# Altium schematic sheet 5DPD8_v1.0_OS_Sheet1.SchDoc: 5DPD8 Controller
size A4; Date: 10th Mar 14; CheckedBy: J. Wong/C. Lai; CompanyName: Makible Ltd.; DrawnBy: Martyn Kay; Engineer: Martyn Kay; Revision: 1.0; SheetNumber: 1; SheetTotal: 4; Website: 5DPrint.com; DesignFileLink: D8 Design Files; BasedOn: Printrboard Rev. B; OSHWLicense: CC BY-SA 4.0
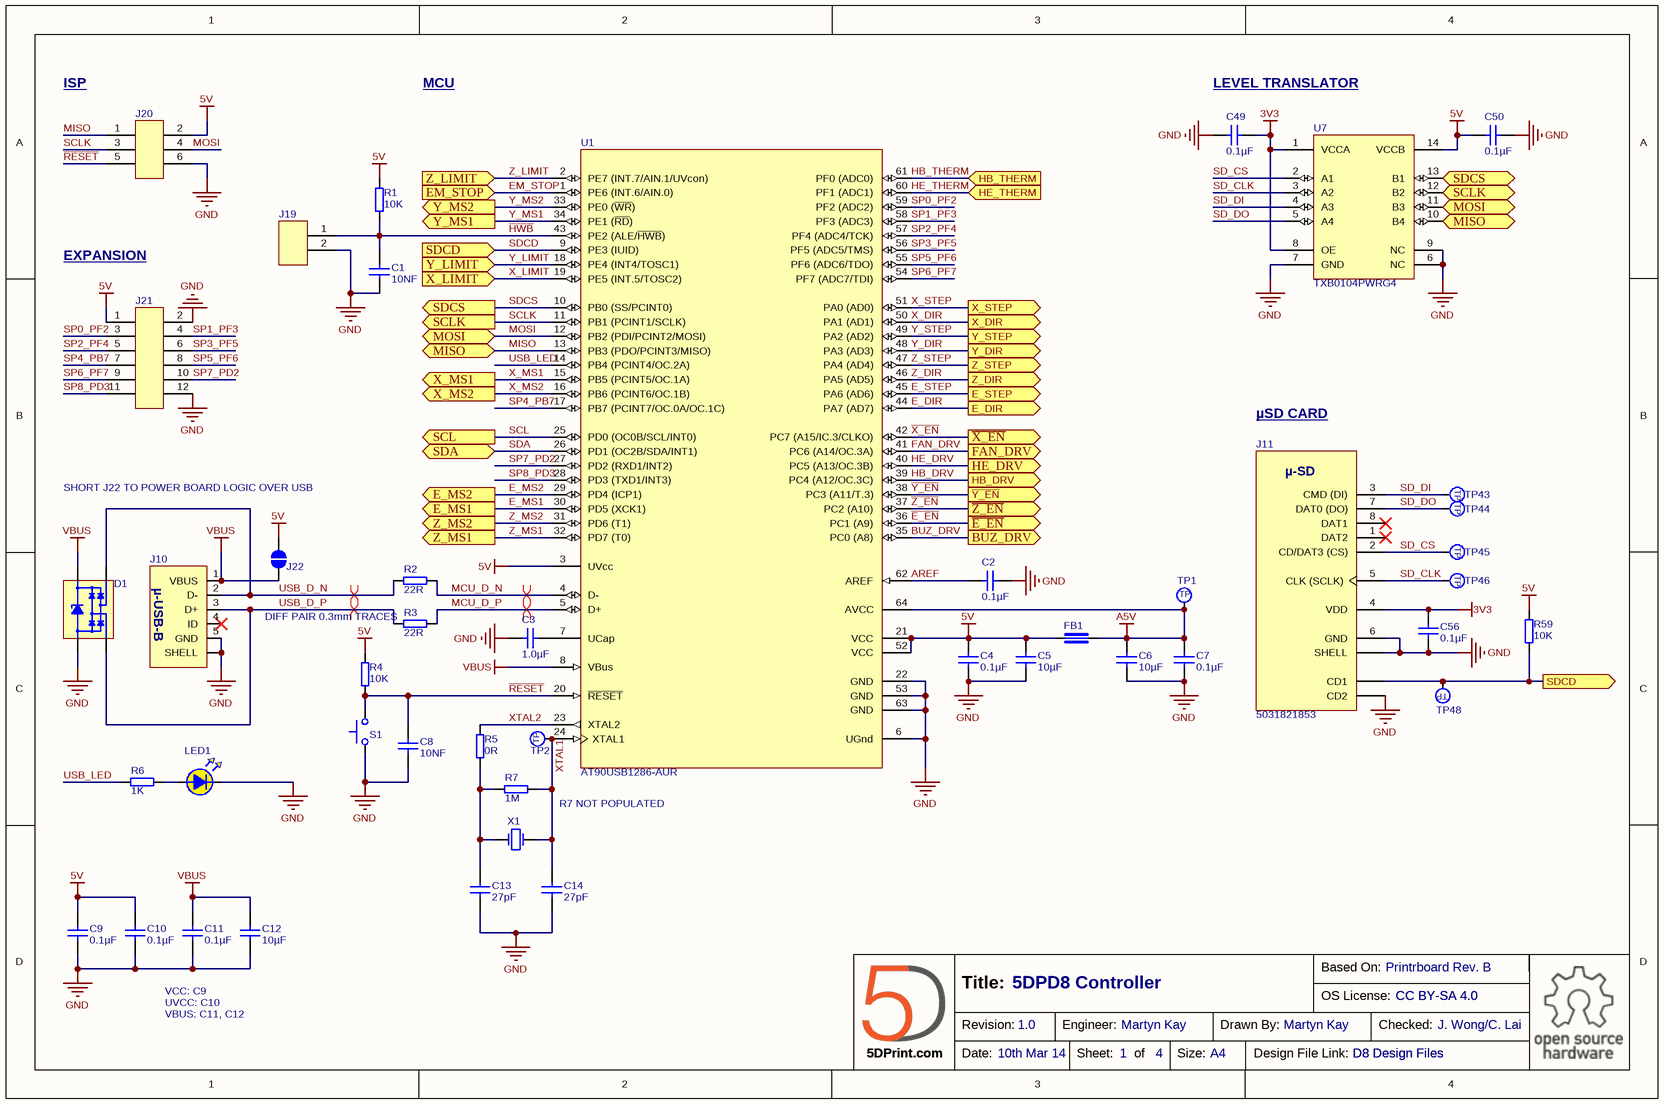
[diagram p0: 5DPD8_v1.0_OS_Sheet1.SchDoc]

## Parts
C1  10NF  [CAPC0603(1608)100_N]
C2  0.1µF  [CAPC0603(1608)100_N]
C3  1.0µF  [CAPC0603(1608)100_N]
C4  0.1µF  [CAPC0603(1608)100_N]
C5  10µF  [CAPC0603(1608)100_N]
C6  10µF  [CAPC0603(1608)100_N]
C7  0.1µF  [CAPC0603(1608)100_N]
C8  10NF  [CAPC0603(1608)100_N]
C9  0.1µF  [CAPC0603(1608)100_N]
C10  0.1µF  [CAPC0603(1608)100_N]
C11  0.1µF  [CAPC0603(1608)100_N]
C12  10µF  [CAPC0603(1608)100_N]
C13  27pF  [CAPC0603(1608)100_N]
C14  27pF  [CAPC0603(1608)100_N]
C49  0.1µF  [CAPC0603(1608)100_N]
C50  0.1µF  [CAPC0603(1608)100_N]
C56  0.1µF  [CAPC0603(1608)100_N]
D1  PRTR5V0U2AX,235  [SOT143B(NXP)]  (value not drawn)
FB1  MMZ1608R301A  [INDC0603(1608)_N]  (value not drawn)
J10  10103594-0001LF  [FCI_THT uUSB]  (value not drawn)
J11  5031821853  [MOLEX_503182-1853]
J19  67996-402HLF  [FCI_67996-402HLF]  (value not drawn)
J20  67996-406HLF  [FCI_67996-406HLF]  (value not drawn)
J21  67996-412HLF  [FCI_67996-412HLF]  (value not drawn)
J22  SOLDER JUMPER  [SOLDER_JUMP]  (value not drawn)  (no BOM)
LED1  HSMY-C190  [LEDC0603(1608)_N-YEL]  (value not drawn)
R1  10K  [RESC0603(1608)_N]
R2  22R  [RESC0603(1608)_N]
R3  22R  [RESC0603(1608)_N]
R4  10K  [RESC0603(1608)_N]
R5  0R  [RESC0603(1608)_N]
R6  1K  [RESC0603(1608)_N]
R7  1M  [RESC0603(1608)_N]  (no BOM)
R59  10K  [RESC0603(1608)_N]
S1  PTS810 SJK 250 SMTR LFS  [PTS810]  (value not drawn)
TP1  TESTPOINT  [TESTPOINT]  (value not drawn)  (no BOM)
TP2  TESTPOINT  [TESTPOINT]  (value not drawn)  (no BOM)
TP43  TESTPOINT  [TESTPOINT]  (value not drawn)  (no BOM)
TP44  TESTPOINT  [TESTPOINT]  (value not drawn)  (no BOM)
TP45  TESTPOINT  [TESTPOINT]  (value not drawn)  (no BOM)
TP46  TESTPOINT  [TESTPOINT]  (value not drawn)  (no BOM)
TP48  TESTPOINT  [TESTPOINT]  (value not drawn)  (no BOM)
U1  AT90USB1286-AUR  [QFP80P1600X1600X120-64_N]
U7  TXB0104PWRG4  [TI-PW14_N]
X1  ABLS-16.000MHZ-K4T  [HC-49US]  (value not drawn)

## Ports
BUZ_DRV (out), E_DIR (out), E_MS1 (out), E_MS2 (out), E_STEP (out), EM_STOP (in), FAN_DRV (out), HB_DRV (out), HB_THERM (in), HE_DRV (out), HE_THERM (in), MISO (bidir), MOSI (bidir), SCL (out), SCLK (in), SCLK (out), SDA (bidir), SDCD (in), SDCD (out), SDCS (in), SDCS (out), X_DIR (out), X_LIMIT (in), X_MS1 (out), X_MS2 (out), X_STEP (out), Y_DIR (out), Y_LIMIT (in), Y_MS1 (out), Y_MS2 (out), Y_STEP (out), Z_DIR (out), Z_LIMIT (in), Z_MS1 (out), Z_MS2 (out), Z_STEP (out), ~{E_EN} (out), ~{X_EN} (out), ~{Y_EN} (out), ~{Z_EN} (out)

## Nets
3V3: C49.2 C56.2 J11.4(VDD) U7.1(VCCA) U7.8(OE)
5V: C4.2 C5.2 C9.2 C10.2 C50.1 FB1.1 J20.2 J21.1 J22.2 R1.2 R4.2 R59.2 U1.3(UVcc) U1.21(VCC) U1.52(VCC) U7.14(VCCB)
A5V: C6.2 C7.2 FB1.2 TP1.1 U1.64(AVCC)
GND: C1.1 C2.2 C3.1 C4.1 C5.1 C6.1 C7.1 C8.1 C9.1 C10.1 C11.1 C12.1 C13.1 C14.1 C49.1 C50.2 C56.1 D1.1(GND) J10.5(GND) J10.M(SHELL) J11.6(GND) J11.CD2 J11.M(SHELL) J19.2 J20.6 J21.2 J21.12 LED1.K S1.1 U1.6(UGnd) U1.22(GND) U1.53(GND) U1.63(GND) U7.6(NC) U7.7(GND) U7.9(NC)
VBUS: C11.2 C12.2 D1.4(VBUS) J10.1(VBUS) J22.1 U1.8(VBus)
AREF: C2.1 U1.62(AREF)
BUZ_DRV: U1.35(PC0_(A8)) ; port BUZ_DRV
~{E_EN}: U1.36(PC1_(A9)) ; port ~{E_EN}
E_DIR: U1.44(PA7_(AD7)) ; port E_DIR
E_MS1: U1.30(PD5_(XCK1)) ; port E_MS1
E_MS2: U1.29(PD4_(ICP1)) ; port E_MS2
E_STEP: U1.45(PA6_(AD6)) ; port E_STEP
EM_STOP: U1.1(PE6_(INT.6/AIN.0)) ; port EM_STOP
FAN_DRV: U1.41(PC6_(A14/OC.3A)) ; port FAN_DRV
~{HWB}: C1.2 J19.1 R1.1 U1.43(PE2_(ALE/~{HWB}))
HB_DRV: U1.39(PC4_(A12/OC.3C)) ; port HB_DRV
HB_THERM: U1.61(PF0_(ADC0)) ; port HB_THERM
HE_DRV: U1.40(PC5_(A13/OC.3B)) ; port HE_DRV
HE_THERM: U1.60(PF1_(ADC1)) ; port HE_THERM
MCU_D_N: R2.2 U1.4(D-)
MCU_D_P: R3.2 U1.5(D+)
MISO: J20.1 U1.13(PB3_(PDO/PCINT3/MISO)) U7.10(B4) ; port MISO
MOSI: J20.4 U1.12(PB2_(PDI/PCINT2/MOSI)) U7.11(B3) ; port MOSI
~{RESET}: C8.2 J20.5 R4.1 S1.3 U1.20(~{RESET})
SCL: U1.25(PD0_(OC0B/SCL/INT0)) ; port SCL
SCLK: J20.3 U1.11(PB1_(PCINT1/SCLK)) U7.12(B2) ; port SCLK
SD_CLK: J11.5(CLK_(SCLK)) TP46.1 U7.3(A2)
SD_CS: J11.2(CD/DAT3_(CS)) TP45.1 U7.2(A1)
SD_DI: J11.3(CMD_(DI)) TP43.1 U7.4(A3)
SD_DO: J11.7(DAT0_(DO)) TP44.1 U7.5(A4)
SDA: U1.26(PD1_(OC2B/SDA/INT1)) ; port SDA
SDCD: J11.CD1 R59.1 TP48.1 U1.9(PE3_(IUID)) ; port SDCD
SDCS: U1.10(PB0_(SS/PCINT0)) U7.13(B1) ; port SDCS
SP0_PF2: J21.3 U1.59(PF2_(ADC2))
SP1_PF3: J21.4 U1.58(PF3_(ADC3))
SP2_PF4: J21.5 U1.57(PF4_(ADC4/TCK))
SP3_PF5: J21.6 U1.56(PF5_(ADC5/TMS))
SP4_PB7: J21.7 U1.17(PB7_(PCINT7/OC.0A/OC.1C))
SP5_PF6: J21.8 U1.55(PF6_(ADC6/TDO))
SP6_PF7: J21.9 U1.54(PF7_(ADC7/TDI))
SP7_PD2: J21.10 U1.27(PD2_(RXD1/INT2))
SP8_PD3: J21.11 U1.28(PD3_(TXD1/INT3))
USB_D_N: D1.3(P2) J10.2(D-) R2.1
USB_D_P: D1.2(P1) J10.3(D+) R3.1
USB_LED: R6.1 U1.14(PB4_(PCINT4/OC.2A))
~{X_EN}: U1.42(PC7_(A15/IC.3/CLKO)) ; port ~{X_EN}
X_DIR: U1.50(PA1_(AD1)) ; port X_DIR
X_LIMIT: U1.19(PE5_(INT.5/TOSC2)) ; port X_LIMIT
X_MS1: U1.15(PB5_(PCINT5/OC.1A)) ; port X_MS1
X_MS2: U1.16(PB6_(PCINT6/OC.1B)) ; port X_MS2
X_STEP: U1.51(PA0_(AD0)) ; port X_STEP
XTAL1: C14.2 R7.2 TP2.1 U1.24(XTAL1) X1.2(OSC2)
XTAL2: R5.2 U1.23(XTAL2)
~{Y_EN}: U1.38(PC3_(A11/T.3)) ; port ~{Y_EN}
Y_DIR: U1.48(PA3_(AD3)) ; port Y_DIR
Y_LIMIT: U1.18(PE4_(INT4/TOSC1)) ; port Y_LIMIT
Y_MS1: U1.34(PE1_(~{RD})) ; port Y_MS1
Y_MS2: U1.33(PE0_(~{WR})) ; port Y_MS2
Y_STEP: U1.49(PA2_(AD2)) ; port Y_STEP
~{Z_EN}: U1.37(PC2_(A10)) ; port ~{Z_EN}
Z_DIR: U1.46(PA5_(AD5)) ; port Z_DIR
Z_LIMIT: U1.2(PE7_(INT.7/AIN.1/UVcon)) ; port Z_LIMIT
Z_MS1: U1.32(PD7_(T0)) ; port Z_MS1
Z_MS2: U1.31(PD6_(T1)) ; port Z_MS2
Z_STEP: U1.47(PA4_(AD4)) ; port Z_STEP
NetC3_2: C3.2 U1.7(UCap)
NetC13_2: C13.2 R5.1 R7.1 X1.1(OSC1)
NetLED1_A: LED1.A R6.2

Not connected (* = marked no-connect by the designer): J10 4(ID)*; J11 1(DAT2)* 8(DAT1)*; S1 2 4

## Layout directives
differential pair: MCU_D_N, MCU_D_P, USB_D_N, USB_D_P

## Notes on the sheet
- ISP
- MCU
- LEVEL TRANSLATOR
- EXPANSION
- µSD CARD
- SHORT J22 TO POWER BOARD LOGIC OVER USB
- DIFF PAIR 0.3mm TRACES
- R7 NOT POPULATED
- VCC: C9
  UVCC: C10
  VBUS: C11, C12
- Based On:
- Title:
- Revision:
- Engineer:
- Drawn By:
- OS License:
- Checked:
- Date:
- Sheet:
- of
- Size:
- A4
- Design File Link:
- (in symbol CON_FCI_10103594-0001LF) µ-USB-B
- (in symbol CON_MLX_503182-1853) µ-SD
- (in symbol TESTPOINT) TP

## Library data of the parts
C1 C8 = C0603-10NF-50V-10%-X7R: CAP CER 10000PF 50V 10% X7R 0603; Manufacturer: Yageo; ManufacturerPartNumber: CC0603KPX7R9BB103; Supplier 1: Digi-Key; RoHS: RoHS Compliant; Category: Capacitors; Stock 1: 15000; Pricing 1: 15000=0.003, 30000=0.00285, 75000=0.00255, 105000=0.00206 (USD); Packaging: Tape & Reel (TR); Capacitance: 10NF; Voltage - Rated: 50V; Tolerance: ±10%; Temperature Coefficient: X7R; Mounting Type: Surface Mount, MLCC; Operating Temperature: -55°C ~ 125°C; Applications: General Purpose; Ratings: -; Package / Case: 0603 (1608 Metric); Size / Dimension: 0.063" L x 0.031" W (1.60mm x 0.80mm); Height - Seated (Max): -; Thickness (Max): 0.035" (0.90mm); Lead Spacing: -; Features: -; Lead Style: -; ComponentLink1URL: http://www.yageo.com/documents/recent/UPY-GPHC_X7R_6.3V-to-50V_8.pdf; ComponentLink1Description: http://www.yageo.com/documents/recent/UPY-GPHC_X7R_6.3V-to-50V_8.pdf; Supplier Part Number 1: 311-1572-2-ND
C2 C4 C7 C9-C11 C49 C50 C56 = C0603-0.1UF-50V-10%-X7R: CAP CER 0.1UF 50V 10% X7R 0603; Manufacturer: Yageo; ManufacturerPartNumber: CC0603KRX7R9BB104; Supplier 1: Digi-Key; RoHS: RoHS Compliant; Category: Capacitors; Stock 1: 2096000; Pricing 1: 4000=0.00513, 8000=0.00468, 12000=0.00446, 28000=0.00424, 100000=0.00307 (USD); Packaging: Tape & Reel (TR); Capacitance: 0.1µF; Voltage - Rated: 50V; Tolerance: ±10%; Temperature Coefficient: X7R; Mounting Type: Surface Mount, MLCC; Operating Temperature: -55°C ~ 125°C; Applications: General Purpose; Ratings: -; Package / Case: 0603 (1608 Metric); Size / Dimension: 0.063" L x 0.031" W (1.60mm x 0.80mm); Height - Seated (Max): -; Thickness (Max): 0.035" (0.90mm); Lead Spacing: -; Features: -; Lead Style: -; ComponentLink1URL: http://www.yageo.com/documents/recent/UPY-GPHC_X7R_6.3V-to-50V_8.pdf; ComponentLink1Description: http://www.yageo.com/documents/recent/UPY-GPHC_X7R_6.3V-to-50V_8.pdf; Supplier Part Number 1: 311-1344-2-ND
C3 = C0603-1UF-10V-10%-X7R: CAP CER 1UF 10V 10% X7R 0603; Manufacturer: Taiyo Yuden; ManufacturerPartNumber: LMK107B7105KA-T; Supplier 1: Digi-Key; RoHS: RoHS Compliant; Category: Capacitors; Stock 1: 116000; Pricing 1: 4000=0.00782, 8000=0.00714, 12000=0.0068, 28000=0.00646 (USD); Packaging: Tape & Reel (TR); Capacitance: 1.0µF; Voltage - Rated: 10V; Tolerance: ±10%; Temperature Coefficient: X7R; Mounting Type: Surface Mount, MLCC; Operating Temperature: -55°C ~ 125°C; Applications: General Purpose; Ratings: -; Package / Case: 0603 (1608 Metric); Size / Dimension: 0.063" L x 0.031" W (1.60mm x 0.80mm); Height - Seated (Max): -; Thickness (Max): 0.035" (0.90mm); Lead Spacing: -; Features: -; Lead Style: -; ComponentLink1URL: http://www.yuden.co.jp/or/product/category/capacitor/LMK107B7105KA-T.pdf; ComponentLink1Description: http://www.yuden.co.jp/or/product/category/capacitor/LMK107B7105KA-T.pdf; Supplier Part Number 1: 587-1242-2-ND
C5 C6 C12 = C0603-10UF-10V-10%-X5R: CAP CER 10UF 10V 10% X5R 0603; Manufacturer: TDK Corporation; ManufacturerPartNumber: C1608X5R1A106K080AC; Supplier 1: Digi-Key; RoHS: RoHS Compliant; Category: Capacitors; Stock 1: 316000; Pricing 1: 4000=0.102, 8000=0.096, 12000=0.093, 28000=0.09, 100000=0.078 (USD); Packaging: Tape & Reel (TR); Capacitance: 10µF; Voltage - Rated: 10V; Tolerance: ±10%; Temperature Coefficient: X5R; Mounting Type: Surface Mount, MLCC; Operating Temperature: -55°C ~ 85°C; Applications: General Purpose; Ratings: -; Package / Case: 0603 (1608 Metric); Size / Dimension: 0.063" L x 0.031" W (1.60mm x 0.80mm); Height - Seated (Max): -; Thickness (Max): 0.035" (0.90mm); Lead Spacing: -; Features: -; Lead Style: -; ComponentLink1URL: http://product.tdk.com/capacitor/mlcc/en/documents/mlcc_commercial_general_en.pdf; ComponentLink1Description: http://product.tdk.com/capacitor/mlcc/en/documents/mlcc_commercial_general_en.pdf; Supplier Part Number 1: 445-7486-2-ND
C13 C14 = C0603-27PF-50V-1%-NP0: CAP CER 27PF 50V 1% NP0 0603; Manufacturer: Murata Electronics North America; ManufacturerPartNumber: GRM1885C1H270FA01D; Temperature Coefficient: C0G, NP0; Supplier 1: Digi-Key; RoHS: RoHS Compliant; Category: Capacitors; Stock 1: 0; Pricing 1: 16000=0.02109 (USD); Packaging: Tape & Reel (TR); Capacitance: 27pF; Voltage - Rated: 50V; Tolerance: ±1%; Mounting Type: Surface Mount, MLCC; Operating Temperature: -55°C ~ 125°C; Applications: General Purpose; Ratings: -; Package / Case: 0603 (1608 Metric); Size / Dimension: 0.063" L x 0.031" W (1.60mm x 0.80mm); Height - Seated (Max): -; Thickness (Max): 0.035" (0.90mm); Lead Spacing: -; Features: -; Lead Style: -; ComponentLink1URL: http://www.murata.com/products/catalog/pdf/c02e.pdf; ComponentLink1Description: http://www.murata.com/products/catalog/pdf/c02e.pdf; Supplier Part Number 1: GRM1885C1H270FA01D-ND
D1 = DIO_PRTR5V0U2AX,235: DIODE ESD PROTECT 5.5V SOT143B; Manufacturer: NXP Semiconductors; Voltage - Breakdown: 6V; Polarization: 2 Channel Array - Bidirectional; Supplier 1: Digi-Key; ManufacturerPartNumber: PRTR5V0U2AX,235; RoHS: RoHS Compliant; Category: Circuit Protection; Stock 1: 0; Pricing 1: 10000=0.15876, 30000=0.15053, 50000=0.147, 100000=0.14465, 250000=0.14112 (USD); Packaging: Tape & Reel (TR); Voltage - Reverse Standoff (Typ): 5.5V; Power (Watts): -; Mounting Type: Surface Mount; Package / Case: TO-253-4, TO-253AA; Supplier Device Package: SOT-143B; ComponentLink1URL: http://www.nxp.com/documents/data_sheet/PRTR5V0U2AX.pdf; ComponentLink1Description: http://www.nxp.com/documents/data_sheet/PRTR5V0U2AX.pdf; Supplier Part Number 1: 568-7445-2-ND
FB1 = MAG_MMZ1608R301A: FERRITE CHIP 300 OHM 500MA 0603; Manufacturer: TDK Corporation; Impedance @ Frequency: 300 Ohm @ 100MHz; DC Resistance (DCR): 250 mOhm Max; Filter Type: Differential Mode - Single; Supplier 1: Digi-Key; ManufacturerPartNumber: MMZ1608R301A; RoHS: RoHS Compliant; Category: Filters; Stock 1: 176000; Pricing 1: 4000=0.0192, 8000=0.0174, 12000=0.0168, 28000=0.0156, 100000=0.01542 (USD); Packaging: Tape & Reel (TR); Current Rating: 500mA; Package / Case: 0603 (1608 Metric); Mounting Type: Surface Mount; Height (Max): 0.037" (0.95mm); Size / Dimension: 0.063" L x 0.031" W (1.60mm x 0.80mm); ComponentLink1URL: http://www.tdk.co.jp/tefe02/e9412_mmz.pdf; ComponentLink1Description: http://www.tdk.co.jp/tefe02/e9412_mmz.pdf; Supplier Part Number 1: 445-2171-2-ND
J10 = CON_FCI_10103594-0001LF: CONN RCPT STD MICRO USB TYPE B; Manufacturer: FCI; Connector Type: USB - micro B; Number of Contacts: 5; Gender: Receptacle; Specifications: USB 2.0; Supplier 1: Digi-Key; ManufacturerPartNumber: 10103594-0001LF; RoHS: RoHS Compliant; Category: Connectors, Interconnects; Stock 1: 6000; Pricing 1: 1500=0.32896, 3000=0.3084, 7500=0.29812, 10500=0.27756, 15000=0.27345, 37500=0.26728 (USD); Packaging: Tape & Reel (TR); Mounting Type: Surface Mount, Right Angle, Horizontal; Features: Shielded, Solder Retention; Ingress Protection: -; ComponentLink1URL: http://portal.fciconnect.com/Comergent//fci/drawing/10103594.pdf; ComponentLink1Description: http://portal.fciconnect.com/Comergent//fci/drawing/10103594.pdf; Supplier Part Number 1: 609-4050-2-ND
J11 = CON_MLX_503182-1853: CONN MICRO SD MEMORY CARD 8CKT; Manufacturer: Molex Inc; Card Type: Secure Digital - microSD™; Number of Positions: 10 (8 + 2); Connector Type: Connector and Ejector; Insertion, Removal Method: Push In, Push Out; Supplier 1: Digi-Key; ManufacturerPartNumber: 5031821853; RoHS: RoHS Compliant; Category: Connectors, Interconnects; Stock 1: 0; Pricing 1: 1600=0.90074, 3200=0.86968, 4800=0.8262, 8000=0.80756 (USD); Packaging: Tape & Reel (TR); Ejector Side: -; Mounting Type: Surface Mount, Right Angle; Features: Switch; Height Above Board: 0.057" (1.45mm); Mounting Feature: Normal, Standard - Top; Contact Finish: Gold; Contact Finish Thickness: -; ComponentLink1URL: http://www.molex.com/pdm_docs/sd/5031821853_sd.pdf; ComponentLink1Description: http://www.molex.com/pdm_docs/sd/5031821853_sd.pdf; Supplier Part Number 1: WM9750TR-ND
J19 = CON_FCI_67996-402HLF: CONN HEADER 2POS .100 STR TIN; Manufacturer: FCI; Current Rating: 3 A; Mounting Angle: Vertical; Voltage Rating: 1.5 kV; Pitch: 2.54 mm; Insulation Resistance: 5000 MOhms; Mating Post Length: 5.84 mm; Number of Positions / Contacts: 2; Supplier 1: Mouser; ManufacturerPartNumber: 67996-402HLF; RoHS: RoHS Compliant; Category: Headers & Wire Housings; Stock 1: 3589; Pricing 1: 1=0.120, 10=0.092, 100=0.077, 500=0.064, 1000=0.055, 2500=0.049, 5000=0.048, 10000=0.047 (USD); Contact Plating: Tin; Housing Material: Thermoplastic; Number of Rows: 2; Packaging: Bulk; Series: BergStik; Termination Style: Through Hole; Type: Unshrouded; Contact Material: Phosphor Bronze; Mounting Style: -; Row Spacing: 2.54 mm; Contact Gender: Pin (Male); Product Category: Bergstik Headers; Product Type: Headers; Standard Pack Qty: 2000; Termination Post Length: 2.41 mm; RoHS - Mouser: Y; Minimum Order Quantity: 1; Reeling: False; ComponentLink1URL: http://portal.fciconnect.com/Comergent/fci/drawing/67996.pdf; ComponentLink1Description: http://portal.fciconnect.com/Comergent/fci/drawing/67996.pdf; Supplier Part Number 1: 649-67996-402HLF
J20 = CON_FCI_67996-406HLF: CONN HEADER 6POS .100 STR TIN; Manufacturer: FCI; Connector Type: Header, Unshrouded; Number of Positions: 6; Number of Positions Loaded: All; Pitch: 0.100" (2.54mm); Supplier 1: Digi-Key; ManufacturerPartNumber: 67996-406HLF; RoHS: RoHS Compliant; Category: Connectors, Interconnects; Stock 1: 6000; Pricing 1: 1=0.26, 10=0.249, 25=0.2132, 50=0.1814, 100=0.1742, 250=0.15644, 500=0.14932, 1000=0.12443, 2500=0.11376 (USD); Packaging: Bulk; Contact Type: Male Pin; Number of Rows: 2; Row Spacing: 0.100" (2.54mm); Contact Mating Length: 0.230" (5.84mm); Mounting Type: Through Hole; Termination: Solder; Fastening Type: -; Features: -; Contact Finish: Tin; Contact Finish Thickness: 100µin (2.54µm); Color: Black; ComponentLink1URL: http://portal.fciconnect.com/Comergent//fci/drawing/67996.pdf; ComponentLink1Description: http://portal.fciconnect.com/Comergent//fci/drawing/67996.pdf; Supplier Part Number 1: 609-3218-ND
J21 = CON_FCI_67996-412HLF: CONN HEADER 12POS .100 STR TIN; Manufacturer: FCI; Connector Type: Header, Unshrouded; Number of Positions: 12; Number of Positions Loaded: All; Pitch: 0.100" (2.54mm); Supplier 1: Digi-Key; ManufacturerPartNumber: 67996-412HLF; RoHS: RoHS Compliant; Category: Connectors, Interconnects; Stock 1: 1651; Pricing 1: 1=0.4, 10=0.379, 25=0.3248, 50=0.276, 100=0.2651, 250=0.23804, 500=0.22722, 1000=0.18935, 2500=0.17312 (USD); Packaging: Bulk; Contact Type: Male Pin; Number of Rows: 2; Row Spacing: 0.100" (2.54mm); Contact Mating Length: 0.230" (5.84mm); Mounting Type: Through Hole; Termination: Solder; Fastening Type: -; Features: -; Contact Finish: Tin; Contact Finish Thickness: 100µin (2.54µm); Color: Black; ComponentLink1URL: http://portal.fciconnect.com/Comergent//fci/drawing/67996.pdf; ComponentLink1Description: http://portal.fciconnect.com/Comergent//fci/drawing/67996.pdf; Supplier Part Number 1: 609-3219-ND
J22 = CON_SOLDER_JUMP
LED1 = LED_HSMY-C190: LED 589NM YELLOW DIFF 0603 SMD; Manufacturer: Avago Technologies US Inc.; Wavelength - Dominant: 586nm; Millicandela Rating: 8mcd; Voltage - Forward (Vf) Typ: 2.1V; Current - Test: 20mA; Viewing Angle: 170°; Lens Type: Diffused; Lens Style/Size: Rectangle with Flat Top, 1mm x 0.8mm; Supplier 1: Digi-Key; ManufacturerPartNumber: HSMY-C190; RoHS: RoHS Compliant; Category: Optoelectronics; Stock 1: 12000; Pricing 1: 4000=0.08, 8000=0.072, 12000=0.064, 28000=0.06, 100000=0.052 (USD); Packaging: Tape & Reel (TR); Color: Yellow; Wavelength - Peak: 589nm; Package / Case: 0603 (1608 Metric); Size / Dimension: 1.60mm L x 0.80mm W; Height: 0.80mm; Mounting Type: Surface Mount; Luminous Flux @ Current - Test: -; ComponentLink1URL: http://www.avagotech.com/docs/AV02-0551EN; ComponentLink1Description: http://www.avagotech.com/docs/AV02-0551EN; Supplier Part Number 1: 516-1424-2-ND
R1 R4 R59 = R0603-10K-0.1W-5%: RES 10K OHM 1/10W 5% 0603 SMD; Manufacturer: Yageo; ManufacturerPartNumber: RC0603JR-0710KL; Power (Watts): 0.1W, 1/10W; Temperature Coefficient: ±100ppm/°C; Supplier 1: Digi-Key; RoHS: RoHS Compliant; Category: Resistors; Stock 1: 0; Pricing 1: 5000=0.00131, 10000=0.00114, 25000=0.001, 50000=0.00092, 125000=0.0009 (USD); Packaging: Tape & Reel (TR); Resistance: 10K; Tolerance: ±5%; Composition: Thick Film; Features: -; Package / Case: 0603 (1608 Metric); Supplier Device Package: 0603; Size / Dimension: 0.063" L x 0.031" W (1.60mm x 0.80mm); Height: 0.022" (0.55mm); Number of Terminations: 2; ComponentLink1URL: http://www.yageo.com/documents/recent/PYu-RC0603_51_RoHS_L_4.pdf; ComponentLink1Description: http://www.yageo.com/documents/recent/PYu-RC0603_51_RoHS_L_4.pdf; Supplier Part Number 1: 311-10KGRTR-ND
R2 R3 = R0603-22R-0.1W-1%: RES 22.0 OHM 1/10W 1% 0603 SMD; Manufacturer: Yageo; ManufacturerPartNumber: RC0603FR-0722RL; Power (Watts): 0.1W, 1/10W; Temperature Coefficient: ±100ppm/°C; Supplier 1: Digi-Key; RoHS: RoHS Compliant; Category: Resistors; Stock 1: 45000; Pricing 1: 5000=0.00171, 10000=0.00149, 25000=0.00131, 50000=0.0012, 125000=0.00117 (USD); Packaging: Tape & Reel (TR); Resistance: 22R; Tolerance: ±1%; Composition: Thick Film; Features: -; Package / Case: 0603 (1608 Metric); Supplier Device Package: 0603; Size / Dimension: 0.063" L x 0.031" W (1.60mm x 0.80mm); Height: 0.022" (0.55mm); Number of Terminations: 2; ComponentLink1URL: http://www.yageo.com/documents/recent/PYu-RC0603_51_RoHS_L_4.pdf; ComponentLink1Description: http://www.yageo.com/documents/recent/PYu-RC0603_51_RoHS_L_4.pdf; Supplier Part Number 1: 311-22.0HRTR-ND
R5 = R0603-0R-0.1W-JUMP: RES ZERO OHM 1/10W JUMP 0603 SMD; Manufacturer: Yageo; ManufacturerPartNumber: RC0603JR-070RL; Tolerance: Jumper; Power (Watts): 0.1W, 1/10W; Supplier 1: Digi-Key; RoHS: RoHS Compliant; Category: Resistors; Stock 1: 2065000; Pricing 1: 5000=0.00131, 10000=0.00114, 25000=0.001, 50000=0.00092, 125000=0.0009 (USD); Packaging: Tape & Reel (TR); Resistance: 0R; Composition: Thick Film; Features: -; Temperature Coefficient: -; Package / Case: 0603 (1608 Metric); Supplier Device Package: 0603; Size / Dimension: 0.063" L x 0.031" W (1.60mm x 0.80mm); Height: 0.022" (0.55mm); Number of Terminations: 2; ComponentLink1URL: http://www.yageo.com/documents/recent/PYu-RC0603_51_RoHS_L_4.pdf; ComponentLink1Description: http://www.yageo.com/documents/recent/PYu-RC0603_51_RoHS_L_4.pdf; Supplier Part Number 1: 311-0.0GRTR-ND
R6 = R0603-1K-0.1W-1%: RES 1.00K OHM 1/10W 1% 0603 SMD; Manufacturer: Yageo; ManufacturerPartNumber: RC0603FR-071KL; Power (Watts): 0.1W, 1/10W; Temperature Coefficient: ±100ppm/°C; Supplier 1: Digi-Key; RoHS: RoHS Compliant; Category: Resistors; Stock 1: 1620000; Pricing 1: 5000=0.00171, 10000=0.00149, 25000=0.00131, 50000=0.0012, 125000=0.00117 (USD); Packaging: Tape & Reel (TR); Resistance: 1K; Tolerance: ±1%; Composition: Thick Film; Features: -; Package / Case: 0603 (1608 Metric); Supplier Device Package: 0603; Size / Dimension: 0.063" L x 0.031" W (1.60mm x 0.80mm); Height: 0.022" (0.55mm); Number of Terminations: 2; ComponentLink1URL: http://www.yageo.com/documents/recent/PYu-RC0603_51_RoHS_L_4.pdf; ComponentLink1Description: http://www.yageo.com/documents/recent/PYu-RC0603_51_RoHS_L_4.pdf; Supplier Part Number 1: 311-1.00KHRTR-ND
R7 = R0603-1M-0.1W-1%: RES 1.00M OHM 1/10W 1% 0603 SMD; Manufacturer: Yageo; ManufacturerPartNumber: RC0603FR-071ML; Power (Watts): 0.1W, 1/10W; Temperature Coefficient: ±100ppm/°C; Supplier 1: Digi-Key; RoHS: RoHS Compliant; Category: Resistors; Stock 1: 1300000; Pricing 1: 5000=0.00171, 10000=0.00149, 25000=0.00131, 50000=0.0012, 125000=0.00117 (USD); Packaging: Tape & Reel (TR); Resistance: 1M; Tolerance: ±1%; Composition: Thick Film; Features: -; Package / Case: 0603 (1608 Metric); Supplier Device Package: 0603; Size / Dimension: 0.063" L x 0.031" W (1.60mm x 0.80mm); Height: 0.022" (0.55mm); Number of Terminations: 2; ComponentLink1URL: http://www.yageo.com/documents/recent/PYu-RC0603_51_RoHS_L_4.pdf; ComponentLink1Description: http://www.yageo.com/documents/recent/PYu-RC0603_51_RoHS_L_4.pdf; Supplier Part Number 1: 311-1.00MHRTR-ND
S1 = SW_PTS810 SJK 250 SMTR LFS: SWITCH TACTILE SPST-NO 0.05A 16V; Manufacturer: C&K Components; Switch Function: Off-Mom; Contact Rating @ Voltage: 0.05A @ 16VDC; Actuator Type: Standard; Actuator Height off PCB, from Pins: 2.50mm; Actuator Orientation: Top Actuated; Outline: 4.20mm x 3.20mm; Illumination: Non-Illuminated; Operating Force: 260gf; Switch Travel: 0.15mm; Mechanical Life: 50,000 Cycles; Supplier 1: Digi-Key; ManufacturerPartNumber: PTS810 SJK 250 SMTR LFS; RoHS: RoHS Compliant; Category: Switches; Stock 1: 14500; Pricing 1: 2900=0.147, 5800=0.1218 (USD); Packaging: Tape & Reel (TR); Circuit: SPST-NO; Mounting Type: Surface Mount; Termination Style: J Lead; Illumination Voltage (Nominal): -; Illumination Type, Color: -; Ingress Protection: -; Features: -; Actuator Material: -; Operating Temperature: -40°C ~ 85°C; ComponentLink1URL: http://www.ck-components.com/80183/pts810_4mar13.pdf/; ComponentLink1Description: http://www.ck-components.com/80183/pts810_4mar13.pdf/; Supplier Part Number 1: CKN10503TR-ND
U1 = IC_AT90USB1286-AUR: IC MCU 8BIT 128KB FLASH 64TQFP; Manufacturer: Atmel; Core Processor: AVR; Core Size: 8-Bit; Speed: 16MHz; Connectivity: EBI/EMI, I²C, SPI, UART/USART, USB, USB OTG; Peripherals: Brown-out Detect/Reset, POR, PWM, WDT; Number of I /O: 48; Program Memory Size: 128KB (128K x 8); EEPROM Size: 4K x 8; RAM Size: 8K x 8; Voltage - Supply (Vcc/Vdd): 2.7 V ~ 5.5 V; Data Converters: A/D 8x10b; Oscillator Type: Internal; Supplier 1: Digi-Key; ManufacturerPartNumber: AT90USB1286-AUR; RoHS: RoHS Compliant; Category: Integrated Circuits (ICs); Stock 1: 0; Pricing 1: 1000=6.295 (USD); Packaging: Tape & Reel (TR); Program Memory Type: FLASH; Operating Temperature: -40°C ~ 85°C; Package / Case: 64-TQFP; ComponentLink1URL: http://www.atmel.com/Images/7593S.pdf; ComponentLink1Description: http://www.atmel.com/Images/7593S.pdf; Supplier Part Number 1: AT90USB1286-AURTR-ND
U7 = IC_TXB0104PWRG4: IC VOLT-LEVEL TRANSLATOR 14TSSOP; Manufacturer: Texas Instruments; Logic Function: Translator, Bidirectional; Number of Bits: 4; Input Type: Logic; Data Rate: 100Mbps; Number of Outputs/Channel: 1; Differential - Input:Output: No/No; Propagation Delay (Max): 4ns; Voltage - Supply: 1.2 V ~ 3.6 V, 1.65 V ~ 5.5 V; Supplier 1: Digi-Key; ManufacturerPartNumber: TXB0104PWRG4; RoHS: RoHS Compliant; Category: Integrated Circuits (ICs); Stock 1: 0; Pricing 1: 2000=0.6552 (USD); Packaging: Tape & Reel (TR); Output Type: Logic; Number of Channels: 4; Operating Temperature: -40°C ~ 85°C; Package / Case: 14-TSSOP (0.173", 4.40mm Width); Supplier Device Package: 14-TSSOP; Mounting Type: Surface Mount; ComponentLink1URL: http://www.ti.com/lit/ds/symlink/txb0104.pdf; ComponentLink1Description: http://www.ti.com/lit/ds/symlink/txb0104.pdf; Supplier Part Number 1: TXB0104PWRG4-ND
X1 = XTAL_ABLS-16.000MHZ-K4T: CRYSTAL 16MHZ 18PF SMD; Manufacturer: Abracon Corporation; Frequency Stability: ±50ppm; Frequency Tolerance: ±30ppm; ESR (Equivalent Series Resistance): 40 Ohm; Operating Mode: Fundamental; Supplier 1: Digi-Key; ManufacturerPartNumber: ABLS-16.000MHZ-K4T; RoHS: RoHS Compliant; Category: Crystals and Oscillators; Stock 1: 11000; Pricing 1: 1000=0.378, 3000=0.3645, 5000=0.351, 10000=0.3375, 25000=0.324 (USD); Packaging: Tape & Reel (TR); Type: MHz Crystal; Frequency: 16MHz; Load Capacitance: 18pF; Operating Temperature: -40°C ~ 125°C; Ratings: -; Mounting Type: Surface Mount; Package / Case: HC49/US; Size / Dimension: 0.449" L x 0.185" W (11.40mm x 4.70mm); Height: 0.165" (4.20mm); ComponentLink1URL: http://www.abracon.com/Resonators/abls.pdf; ComponentLink1Description: http://www.abracon.com/Resonators/abls.pdf; Supplier Part Number 1: 535-9948-2-ND